# Altium schematic sheet 01 Cover.SchDoc
size A3
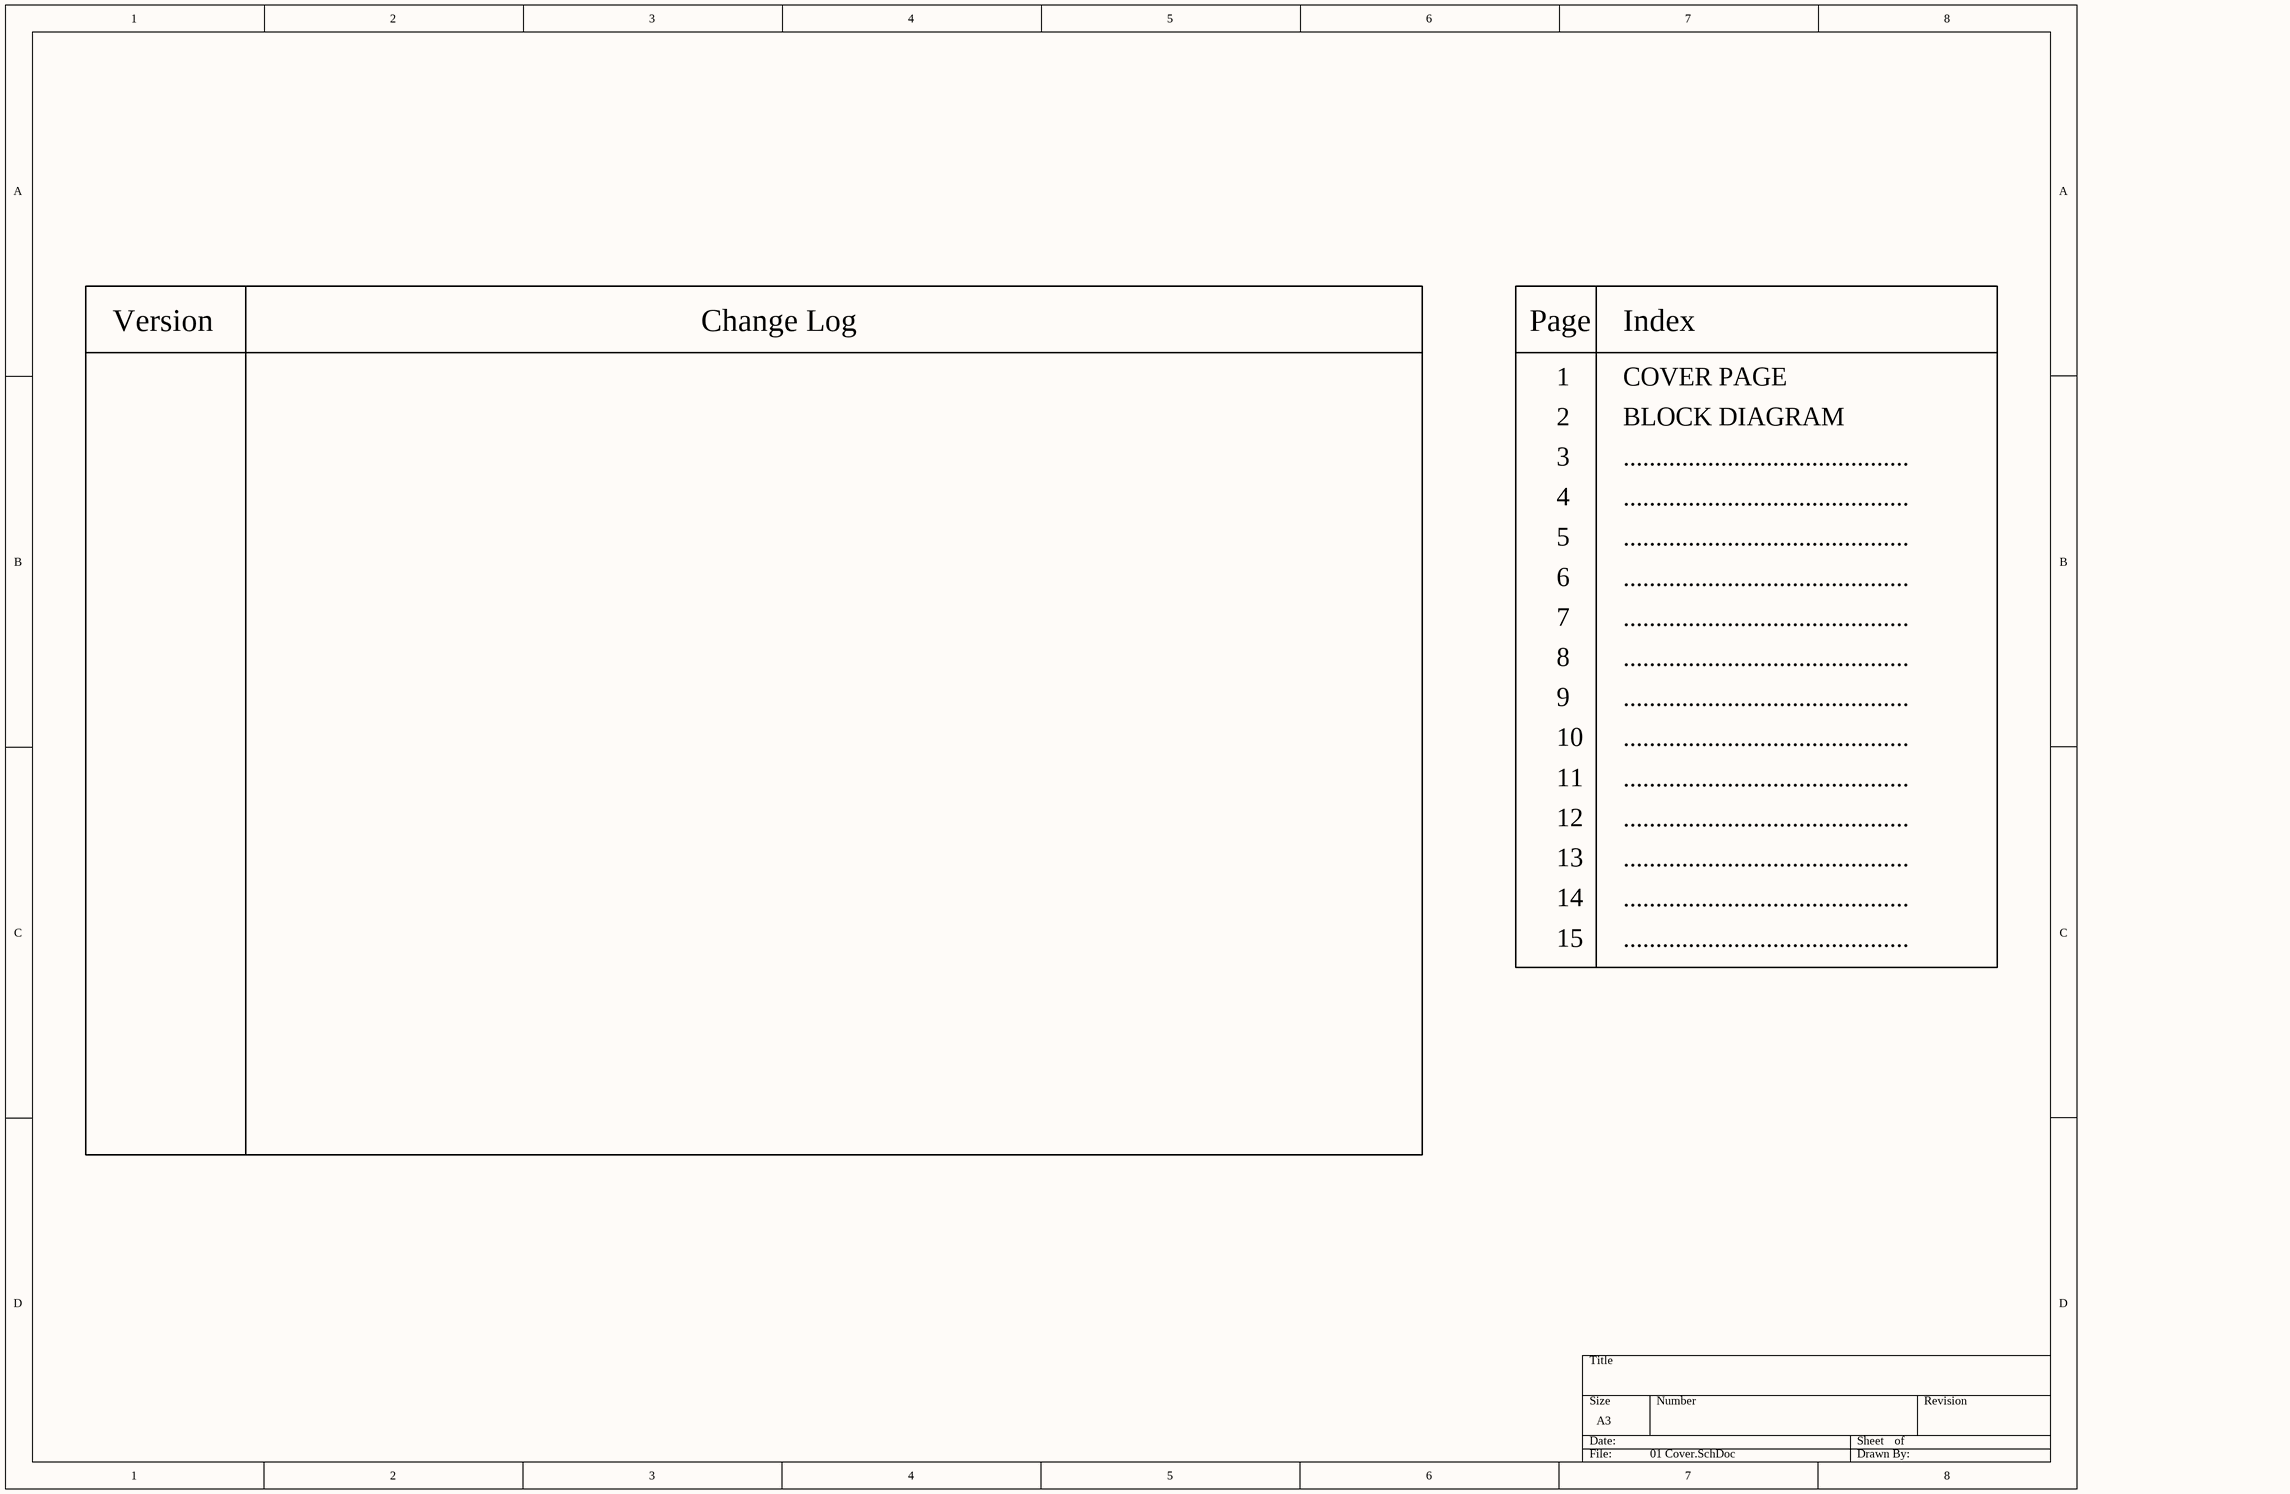
[diagram p0: 01 Cover.SchDoc]

## Notes on the sheet
- Version
- Change Log
- Page
- Index
- 1
- 2
- COVER PAGE
- BLOCK DIAGRAM
- 3
- 4
- ............................................
- 5
- 6
- 7
- 8
- 9
- 10
- 11
- 12
- 13
- 14
- 15